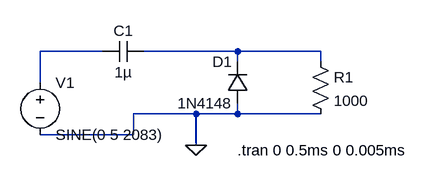
[diagram p0: schematic Clamper.asc]
Clamper.asc, the LTspice schematic file:
Version 4
SHEET 1 880 680
WIRE 80 64 -16 64
WIRE 288 64 144 64
WIRE 416 64 288 64
WIRE 288 80 288 64
WIRE 416 80 416 64
WIRE -16 112 -16 64
WIRE 224 160 128 160
WIRE 288 160 288 144
WIRE 288 160 224 160
WIRE 416 160 288 160
WIRE 128 192 128 160
WIRE 128 192 -16 192
WIRE 224 208 224 160
FLAG 224 208 0
SYMBOL voltage -16 96 R0
WINDOW 123 0 0 Left 0
WINDOW 39 0 0 Left 0
SYMATTR InstName V1
SYMATTR Value SINE(0 5 2083)
SYMBOL cap 144 48 R90
WINDOW 0 0 32 VBottom 2
WINDOW 3 32 32 VTop 2
SYMATTR InstName C1
SYMATTR Value 1µ
SYMBOL diode 304 144 R180
WINDOW 0 24 64 Left 2
WINDOW 3 24 0 Left 2
SYMATTR InstName D1
SYMATTR Value 1N4148
SYMBOL res 400 64 R0
SYMATTR InstName R1
SYMATTR Value 1000
TEXT 288 216 Left 2 !.tran 0 0.5ms 0 0.005ms

The netlist it stands for:
* Clamper.asc
V1 N001 0 SINE(0 5 2083)
C1 N002 N001 1µ
D1 0 N002 1N4148
R1 N002 0 1000
.model D D
.lib standard.dio
.tran 0 0.5ms 0 0.005ms
.backanno
.end